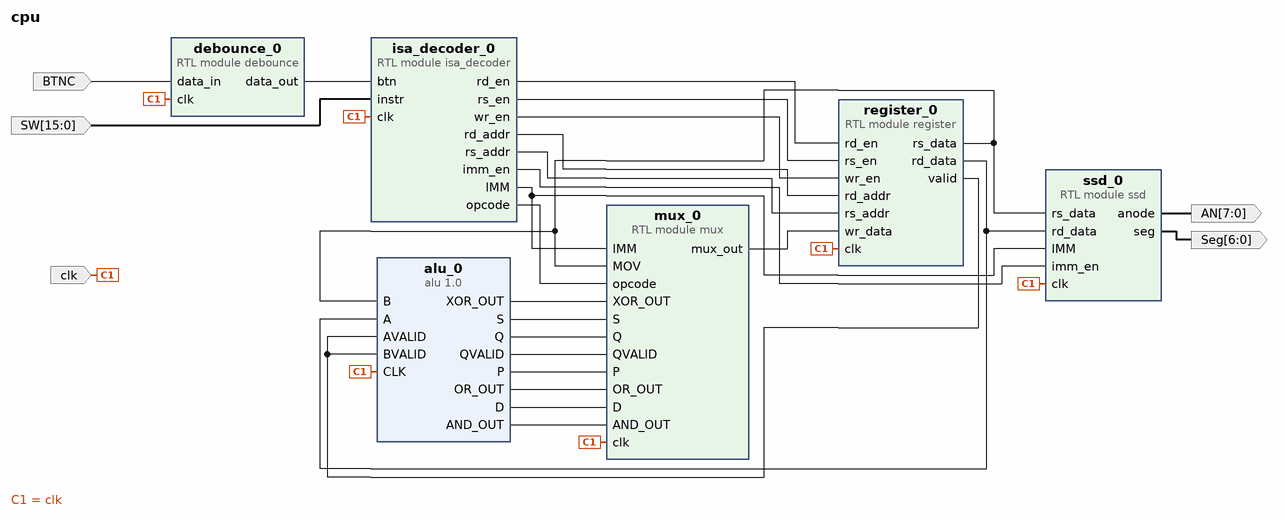
[diagram p0: block diagram of the top level]
# Vivado block design cpu, xc7a100tcsg324-1, Vivado 2019.2
create_bd_design cpu

create_bd_port -dir I clk
create_bd_port -dir I BTNC
create_bd_port -dir I -from 15 -to 0 SW
create_bd_port -dir O -from 7 -to 0 AN
create_bd_port -dir O -from 6 -to 0 Seg

create_bd_cell -type module -reference debounce debounce_0
create_bd_cell -type module -reference register register_0
create_bd_cell -type ip -vlnv xilinx.com:user:alu:1.0 alu_0
create_bd_cell -type module -reference ssd ssd_0
create_bd_cell -type module -reference isa_decoder isa_decoder_0
create_bd_cell -type module -reference mux mux_0

# ---- connections ----

connect_bd_net [get_bd_pins isa_decoder_0/rd_en] [get_bd_pins register_0/rd_en]
connect_bd_net [get_bd_pins isa_decoder_0/rs_en] [get_bd_pins register_0/rs_en]
connect_bd_net [get_bd_pins isa_decoder_0/wr_en] [get_bd_pins register_0/wr_en]
connect_bd_net [get_bd_pins register_0/rd_data] [get_bd_pins alu_0/A] [get_bd_pins ssd_0/rd_data]
connect_bd_net [get_bd_pins register_0/rs_data] [get_bd_pins alu_0/B] [get_bd_pins ssd_0/rs_data] [get_bd_pins mux_0/MOV]
connect_bd_net [get_bd_pins isa_decoder_0/IMM] [get_bd_pins ssd_0/IMM] [get_bd_pins mux_0/IMM]
connect_bd_net [get_bd_pins isa_decoder_0/rd_addr] [get_bd_pins register_0/rd_addr]
connect_bd_net [get_bd_pins isa_decoder_0/rs_addr] [get_bd_pins register_0/rs_addr]
connect_bd_net [get_bd_pins isa_decoder_0/opcode] [get_bd_pins mux_0/opcode]
connect_bd_net [get_bd_pins isa_decoder_0/imm_en] [get_bd_pins ssd_0/imm_en]
connect_bd_net [get_bd_pins debounce_0/data_out] [get_bd_pins isa_decoder_0/btn]
connect_bd_net -net clki_1 [get_bd_ports clk] \
  [get_bd_pins debounce_0/clk] [get_bd_pins register_0/clk] [get_bd_pins alu_0/CLK] [get_bd_pins ssd_0/clk] \
  [get_bd_pins isa_decoder_0/clk] [get_bd_pins mux_0/clk]
connect_bd_net [get_bd_pins mux_0/mux_out] [get_bd_pins register_0/wr_data]
connect_bd_net [get_bd_ports BTNC] [get_bd_pins debounce_0/data_in]
connect_bd_net [get_bd_ports SW] [get_bd_pins isa_decoder_0/instr]
connect_bd_net [get_bd_pins ssd_0/anode] [get_bd_ports AN]
connect_bd_net [get_bd_pins ssd_0/seg] [get_bd_ports Seg]
connect_bd_net [get_bd_pins alu_0/XOR_OUT] [get_bd_pins mux_0/XOR_OUT]
connect_bd_net [get_bd_pins alu_0/S] [get_bd_pins mux_0/S]
connect_bd_net [get_bd_pins alu_0/Q] [get_bd_pins mux_0/Q]
connect_bd_net [get_bd_pins register_0/valid] [get_bd_pins alu_0/AVALID] [get_bd_pins alu_0/BVALID]
connect_bd_net [get_bd_pins alu_0/QVALID] [get_bd_pins mux_0/QVALID]
connect_bd_net [get_bd_pins alu_0/P] [get_bd_pins mux_0/P]
connect_bd_net [get_bd_pins alu_0/OR_OUT] [get_bd_pins mux_0/OR_OUT]
connect_bd_net [get_bd_pins alu_0/D] [get_bd_pins mux_0/D]
connect_bd_net [get_bd_pins alu_0/AND_OUT] [get_bd_pins mux_0/AND_OUT]

validate_bd_design
save_bd_design
